# EAGLE schematic Mixer-Analog-LM3900-Rev-B (EAGLE 8.4.3)
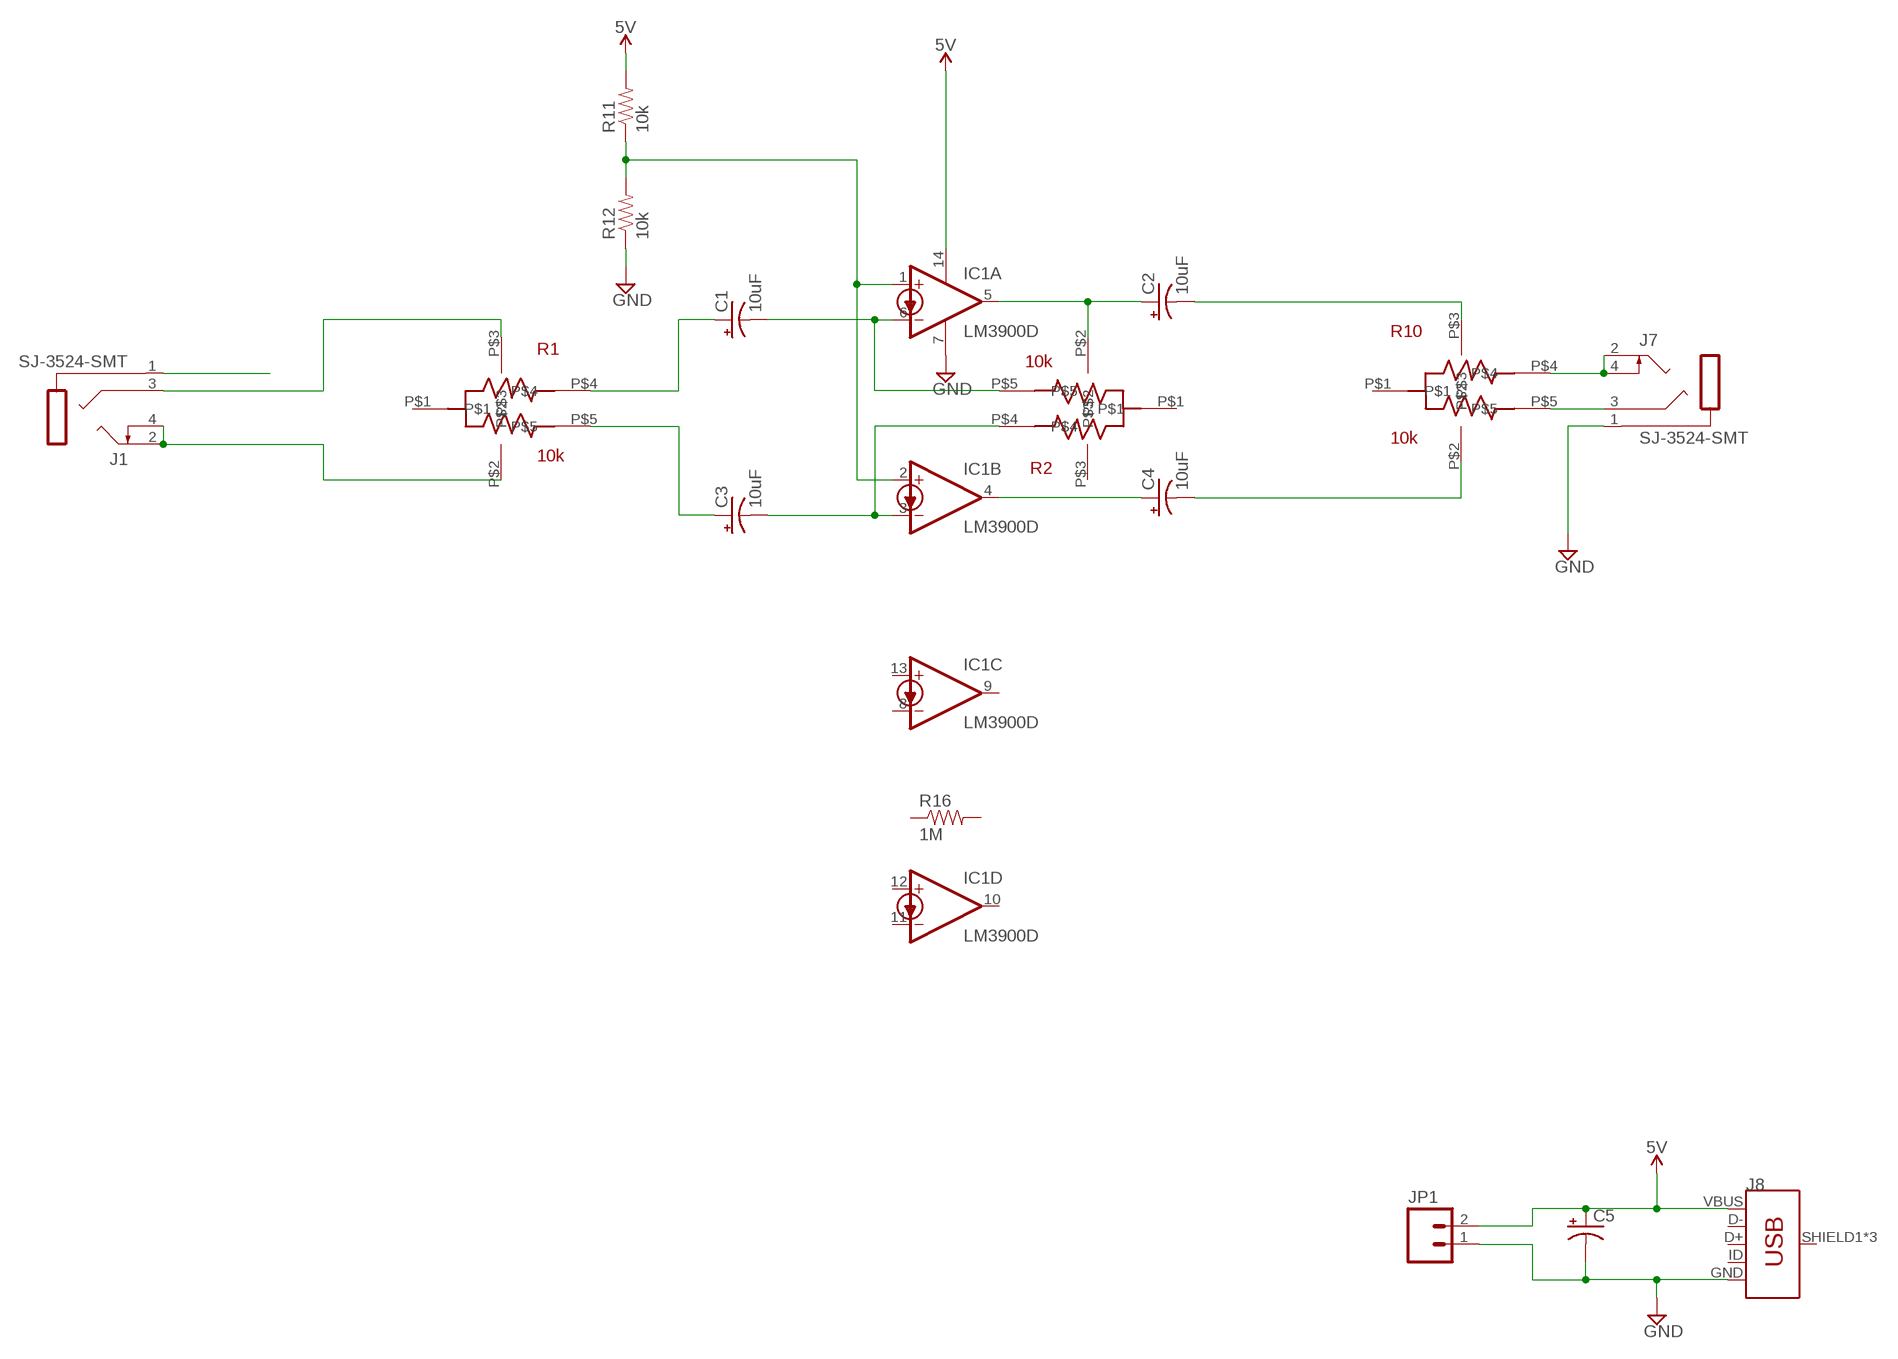
[diagram p0: schematic, sheet 1]

## Parts
C1  10uF  CAP_POL1206-KIT  [EIA3216-KIT]
C2  10uF  CAP_POL1206-KIT  [EIA3216-KIT]
C3  10uF  CAP_POL1206-KIT  [EIA3216-KIT]
C4  10uF  CAP_POL1206-KIT  [EIA3216-KIT]
C5  CAP_POLPTH1  [CPOL-RADIAL-100UF-25V]
IC1  LM3900D  [SO14]
J1  SJ-3524-SMT  [SJ-3524-SMT]
J7  SJ-3524-SMT  [SJ-3524-SMT]
J8  USB_MICRO-B_FEMALE-SMT  [USB-B-MICRO-SMD]
JP1  M02LOCK  [1X02_LOCK]
R1  10k  POT-DUAL-ALPS-RK10J12E0A0A  [POT-DUAL-ALPS-RK10J12E0A0A]
R2  10k  POT-DUAL-ALPS-RK10J12E0A0A  [POT-DUAL-ALPS-RK10J12E0A0A]
R10  10k  POT-DUAL-ALPS-RK10J12E0A0A  [POT-DUAL-ALPS-RK10J12E0A0A]
R11  10k  RESISTOR1206  [1206]
R12  10k  RESISTOR1206  [1206]
R16  1M  RESISTOR1206  [1206]

## Nets
5V: C5.1(+) IC1.14(P:V+) J8.VBUS JP1.2 R11.2
GND: C5.2(-) IC1.7(P:GND) J7.1(S) J8.GND JP1.1 R12.1
N$1: C3.C(-) IC1.3(B:-IN) R2.P$4
N$2: IC1.1(A:+IN) IC1.2(B:+IN) R11.1 R12.2
N$6: J1.1(S)
N$7: C4.C(-) R10.P$2
N$18: C2.A(+) IC1.5(A:OUT) R2.P$2
N$21: C1.C(-) IC1.6(A:-IN) R2.P$5
N$24: C4.A(+) IC1.4(B:OUT)
N$35: C3.A(+) R1.P$5
N$36: C1.A(+) R1.P$4
N$37: J1.2(T) J1.4(TS) R1.P$2
N$40: J1.3(R) R1.P$3
N$61: J7.2(T) J7.4(TS) R10.P$4
N$62: J7.3(R) R10.P$5
N$111: C2.C(-) R10.P$3
Unconnected: IC1.8(C:-IN) IC1.9(C:OUT) IC1.10(D:OUT) IC1.11(D:-IN) IC1.12(D:+IN) IC1.13(C:+IN) J8.D+ J8.D- J8.ID J8.SHIELD1(SHIELD) J8.SHIELD2(SHIELD) J8.SHIELD3(SHIELD) R1.P$1 R2.P$1 R2.P$3 R10.P$1 R16.1 R16.2

## Library data of the parts
C1-C5 = SparkFun-Passives:CAP_POL: Capacitor Polarized These are standard SMD and PTH capacitors. Normally 10uF, 47uF, and 100uF in electrolytic and tantalum varieties. Always verify the external diameter of the through hole cap, it varies with capacity, voltage, and manufacturer. The EIA devices should be standard.
IC1 = linear:LM3900: OP AMP
J1 J7 = con-cuistack:SJ-3524: 3.5 Stereo audio jack (SMT)
J8 = SparkFun-Connectors:USB_MICRO-B: USB Type Micro-B Connector Male/female and PTH/SMT variants SparkFun Products: SparkFun microB USB Breakout <https://www.sparkfun.com/products/12035> SparkFun USB microB Plug Breakout <https://www.sparkfun.com/products/10031> SparkFun ESP8266 Thing <https://www.sparkfun.com/products/13231>; PROD_ID: CONN-11752
JP1 = CMU-ArtFab:M02: Header 2 Standard 2-pin 0.1" header. Use with straight break away headers (SKU : PRT-00116), right angle break away headers (PRT-00553), swiss pins (PRT-00743), machine pins (PRT-00117), and female headers (PRT-00115). Molex polarized connector foot print use with SKU : PRT-08233 with associated crimp pins and housings.
R1 R2 R10 = CMU-ArtFab:POT-DUAL-ALPS-RK10J12E0A0A
R11 R12 R16 = SparkFun-Passives:RESISTOR: Resistor Basic schematic elements and footprints for 0603, 1206, and PTH resistors.